# Altium schematic sheet LPCB235 - HEC5-8.SchDoc
size A3; Address1: Factory 10; Address2: 9-13 Dingley Avenue, Dandeong, VICTORIA 3175, AUSTRALIA; DocumentNumber: 5; Revision: 1; SheetNumber: 5; SheetTotal: 37; Lockie__PCB_SUB_ASSEMBLY: HEC 5-8; Lockie__PCB_ASSEMBLY: FCU PCB; Lockie__LDL: LPCB235; Lockie__PCB_DESCRIPTION: Flight Control Unit
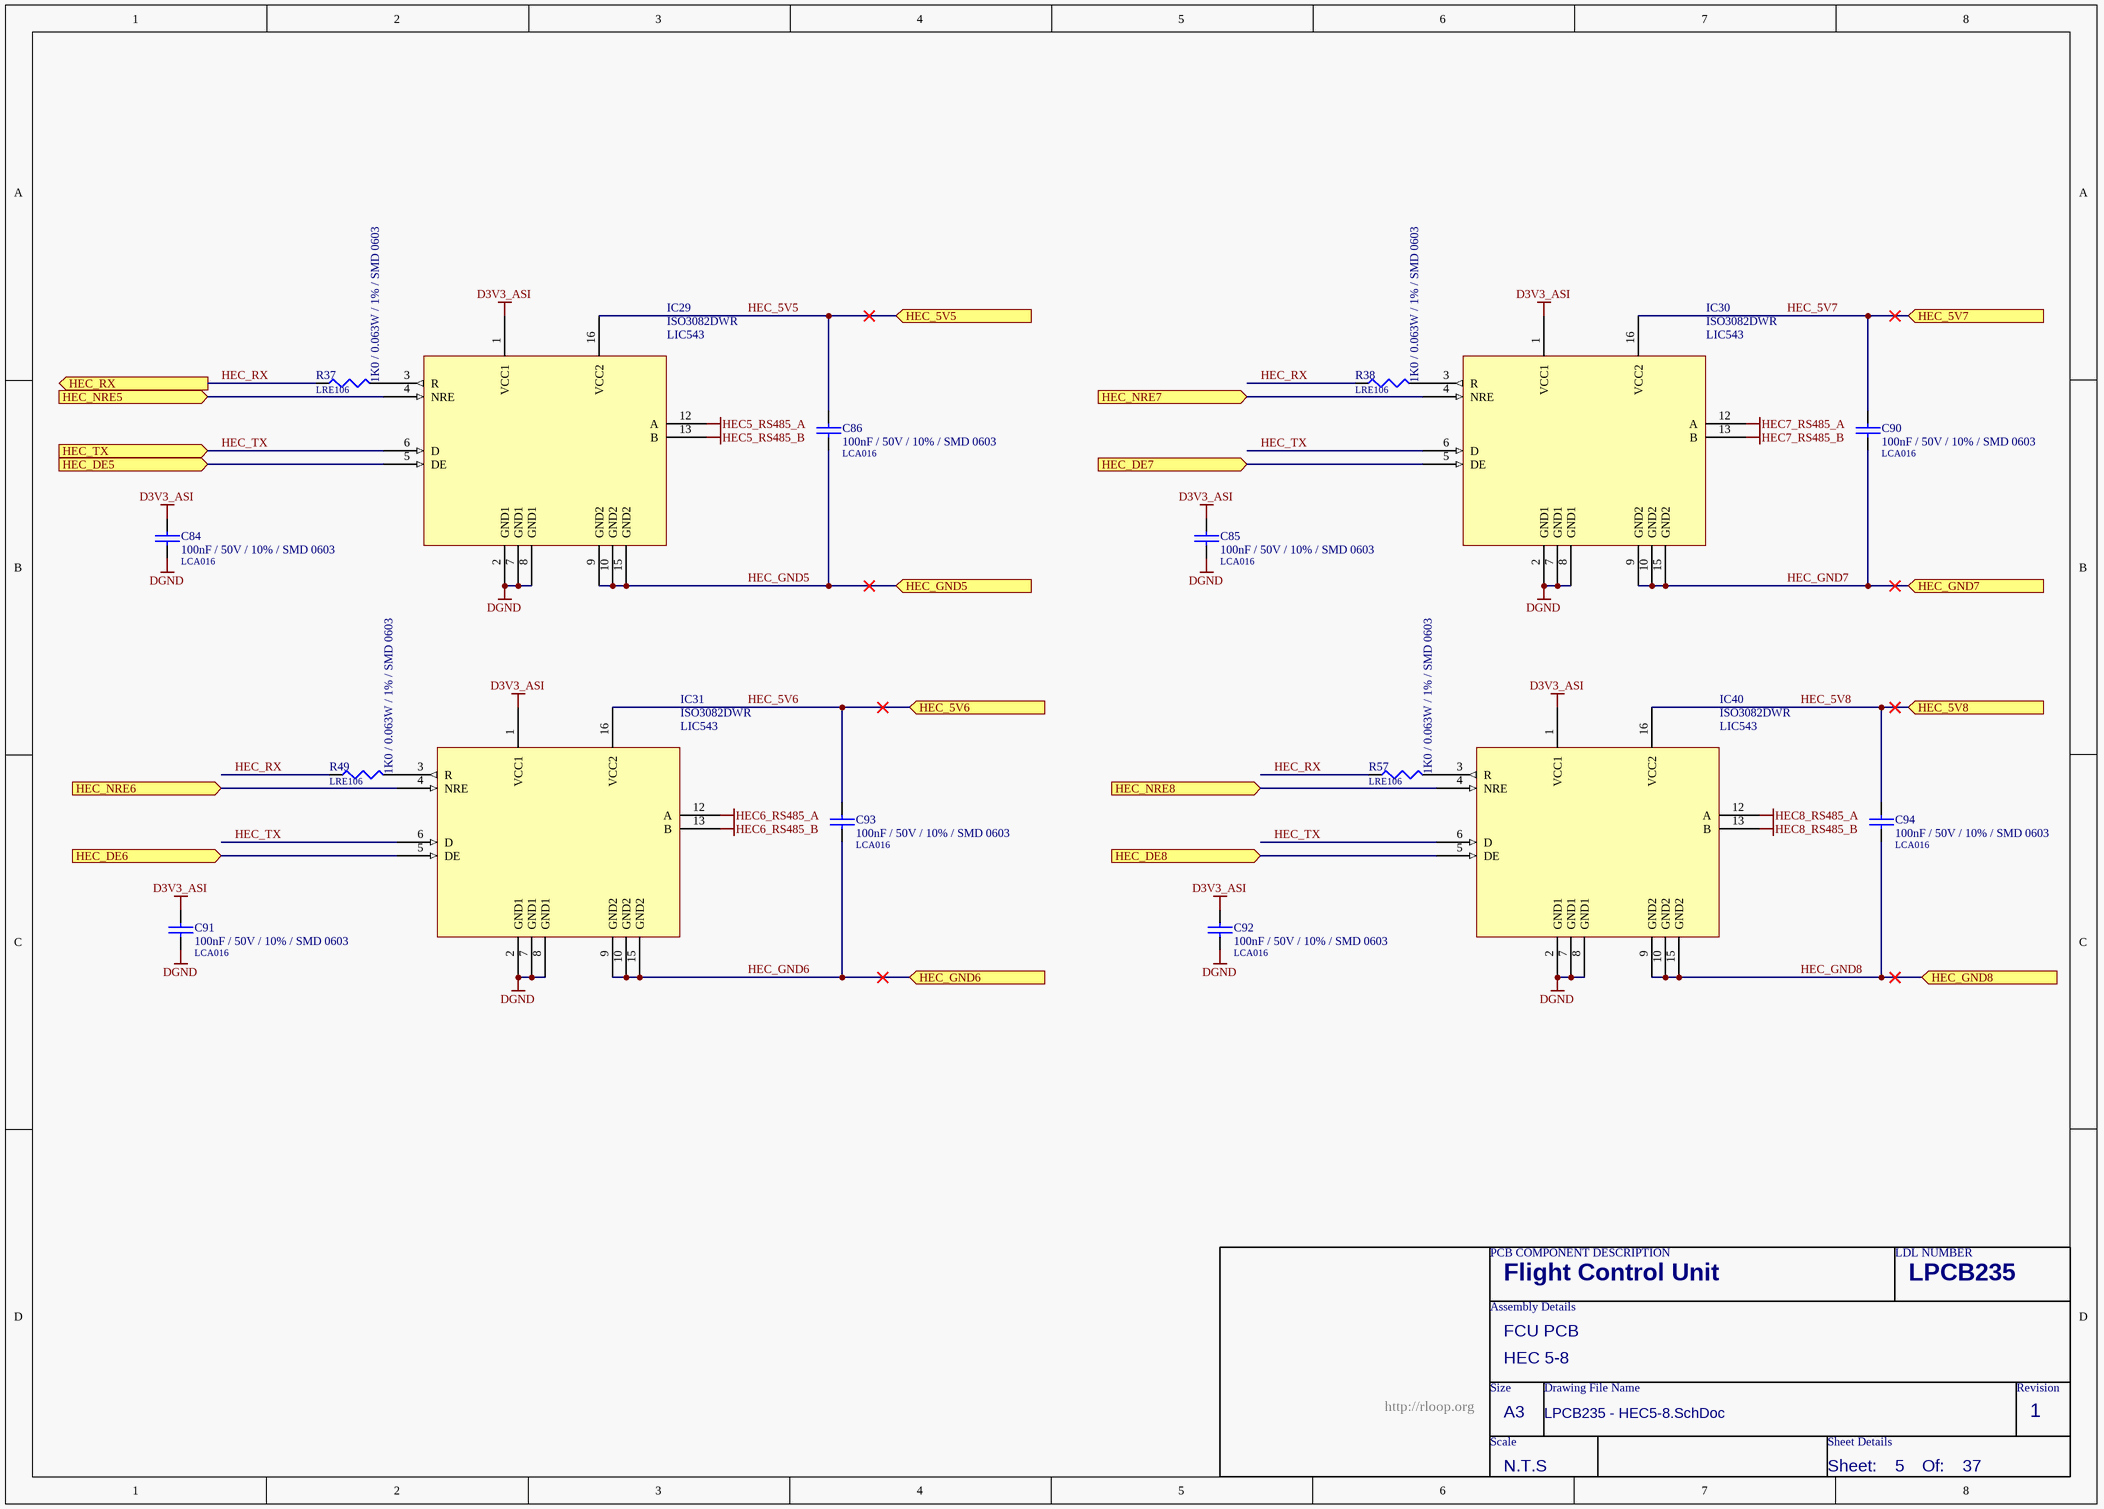
[diagram p0: LPCB235 - HEC5-8.SchDoc]

## Parts
C84  100nF / 50V / 10% / SMD 0603  LDL_NUMBER: LCA016  [LFP011__CC1608-0603-IPC7351_B]
C85  100nF / 50V / 10% / SMD 0603  LDL_NUMBER: LCA016  [LFP011__CC1608-0603-IPC7351_B]
C86  100nF / 50V / 10% / SMD 0603  LDL_NUMBER: LCA016  [LFP011__CC1608-0603-IPC7351_B]
C90  100nF / 50V / 10% / SMD 0603  LDL_NUMBER: LCA016  [LFP011__CC1608-0603-IPC7351_B]
C91  100nF / 50V / 10% / SMD 0603  LDL_NUMBER: LCA016  [LFP011__CC1608-0603-IPC7351_B]
C92  100nF / 50V / 10% / SMD 0603  LDL_NUMBER: LCA016  [LFP011__CC1608-0603-IPC7351_B]
C93  100nF / 50V / 10% / SMD 0603  LDL_NUMBER: LCA016  [LFP011__CC1608-0603-IPC7351_B]
C94  100nF / 50V / 10% / SMD 0603  LDL_NUMBER: LCA016  [LFP011__CC1608-0603-IPC7351_B]
IC29  ISO3082DWR  LDL_NUMBER: LIC543  [LFP068__SO-G16/G6.9]
IC30  ISO3082DWR  LDL_NUMBER: LIC543  [LFP068__SO-G16/G6.9]
IC31  ISO3082DWR  LDL_NUMBER: LIC543  [LFP068__SO-G16/G6.9]
IC40  ISO3082DWR  LDL_NUMBER: LIC543  [LFP068__SO-G16/G6.9]
R37  1K0 / 0.063W / 1% / SMD 0603  LDL_NUMBER: LRE106  [LFP020__CR1608-0603-IPC7351_B]
R38  1K0 / 0.063W / 1% / SMD 0603  LDL_NUMBER: LRE106  [LFP020__CR1608-0603-IPC7351_B]
R49  1K0 / 0.063W / 1% / SMD 0603  LDL_NUMBER: LRE106  [LFP020__CR1608-0603-IPC7351_B]
R57  1K0 / 0.063W / 1% / SMD 0603  LDL_NUMBER: LRE106  [LFP020__CR1608-0603-IPC7351_B]

## Ports
HEC_5V5 (in), HEC_5V6 (in), HEC_5V7 (in), HEC_5V8 (in), HEC_DE5 (in), HEC_DE6 (in), HEC_DE7 (in), HEC_DE8 (in), HEC_GND5 (in), HEC_GND6 (in), HEC_GND7 (in), HEC_GND8 (in), HEC_NRE5 (in), HEC_NRE6 (in), HEC_NRE7 (in), HEC_NRE8 (in), HEC_RX (out), HEC_TX (in)

## Nets
D3V3_ASI: C84.1 C85.1 C91.1 C92.1 IC29.1(VCC1) IC30.1(VCC1) IC31.1(VCC1) IC40.1(VCC1)
DGND: C84.2 C85.2 C91.2 C92.2 IC29.2(GND1) IC29.7(GND1) IC29.8(GND1) IC30.2(GND1) IC30.7(GND1) IC30.8(GND1) IC31.2(GND1) IC31.7(GND1) IC31.8(GND1) IC40.2(GND1) IC40.7(GND1) IC40.8(GND1)
HEC5_RS485_A: IC29.12(A)
HEC5_RS485_B: IC29.13(B)
HEC6_RS485_A: IC31.12(A)
HEC6_RS485_B: IC31.13(B)
HEC7_RS485_A: IC30.12(A)
HEC7_RS485_B: IC30.13(B)
HEC8_RS485_A: IC40.12(A)
HEC8_RS485_B: IC40.13(B)
HEC_5V5: C86.1 IC29.16(VCC2) ; port HEC_5V5
HEC_5V6: C93.1 IC31.16(VCC2) ; port HEC_5V6
HEC_5V7: C90.1 IC30.16(VCC2) ; port HEC_5V7
HEC_5V8: C94.1 IC40.16(VCC2) ; port HEC_5V8
HEC_DE5: IC29.5(DE) ; port HEC_DE5
HEC_DE6: IC31.5(DE) ; port HEC_DE6
HEC_DE7: IC30.5(DE) ; port HEC_DE7
HEC_DE8: IC40.5(DE) ; port HEC_DE8
HEC_GND5: C86.2 IC29.9(GND2) IC29.10(GND2) IC29.15(GND2) ; port HEC_GND5
HEC_GND6: C93.2 IC31.9(GND2) IC31.10(GND2) IC31.15(GND2) ; port HEC_GND6
HEC_GND7: C90.2 IC30.9(GND2) IC30.10(GND2) IC30.15(GND2) ; port HEC_GND7
HEC_GND8: C94.2 IC40.9(GND2) IC40.10(GND2) IC40.15(GND2) ; port HEC_GND8
HEC_NRE5: IC29.4(NRE) ; port HEC_NRE5
HEC_NRE6: IC31.4(NRE) ; port HEC_NRE6
HEC_NRE7: IC30.4(NRE) ; port HEC_NRE7
HEC_NRE8: IC40.4(NRE) ; port HEC_NRE8
HEC_RX: R37.1 R38.1 R49.1 R57.1 ; port HEC_RX
HEC_TX: IC29.6(D) IC30.6(D) IC31.6(D) IC40.6(D) ; port HEC_TX
NetIC29_3: IC29.3(R) R37.2
NetIC30_3: IC30.3(R) R38.2
NetIC31_3: IC31.3(R) R49.2
NetIC40_3: IC40.3(R) R57.2

## Notes on the sheet
- PCB COMPONENT DESCRIPTION
- LDL NUMBER
- Assembly Details
- Size
- Drawing File Name
- Revision
- http://rloop.org
- Scale
- A3
- Sheet Details
- N.T.S
- Sheet:
- Of:

## Library data of the parts
C84-C86 C90-C94 = 100nF / 50V / 10% / SMD 0603: Capacitor, Ceramic Chip, 100nF (0.1uF), 50V, 5%, SMD 0603 [LCA016]; Value: 100n; FMEDA__OPERATING__VOLTAGE_MIN: 0; FMEDA__OPERATING__VOLTAGE_MAX: 3.3; FMEDA__OPERATING__TEMP_MIN: -20; FMEDA__OPERATING__TEMP_TYP: 27; FMEDA__OPERATING__TEMP_MAX: 50; FMEDA__CHANNEL: COM; FMEDA__FUNCTION_IN_SYSTEM: *; FMEDA__OPERATING__VOLTAGE_TYP: 3.3
IC29-IC31 IC40 = ISO3082DWR: IC, RS485 Isolator, SMD SOIC 16 [LIC543]
R37 R38 R49 R57 = 1K0 / 0.063W / 1% / SMD 0603: Resistor, Ceramic Chip, 1K0, 0.063W, 1%, SMD 0603 [LRE106]; Value: 1K; FMEDA__OPERATING__POWER_MAX: 0; FMEDA__OPERATING__TEMP_MAX: 50; FMEDA__OPERATING__TEMP_MIN: -20; FMEDA__OPERATING__TEMP_TYP: 27; FMEDA__CHANNEL: COM; FMEDA__OPERATING__POWER_MIN: 0; FMEDA__OPERATING__VOLTAGE_MAX: 0; FMEDA__OPERATING__VOLTAGE_MIN: 0; FMEDA__OPERATING__VOLTAGE_TYP: 0; FMEDA__FUNCTION_IN_SYSTEM: *